# EAGLE design Adafruit DRV8871 (EAGLE 6.6.0)
COMPANY: ADAFRUIT INDUSTRIES; DRAWN: KTOWN; REV: A
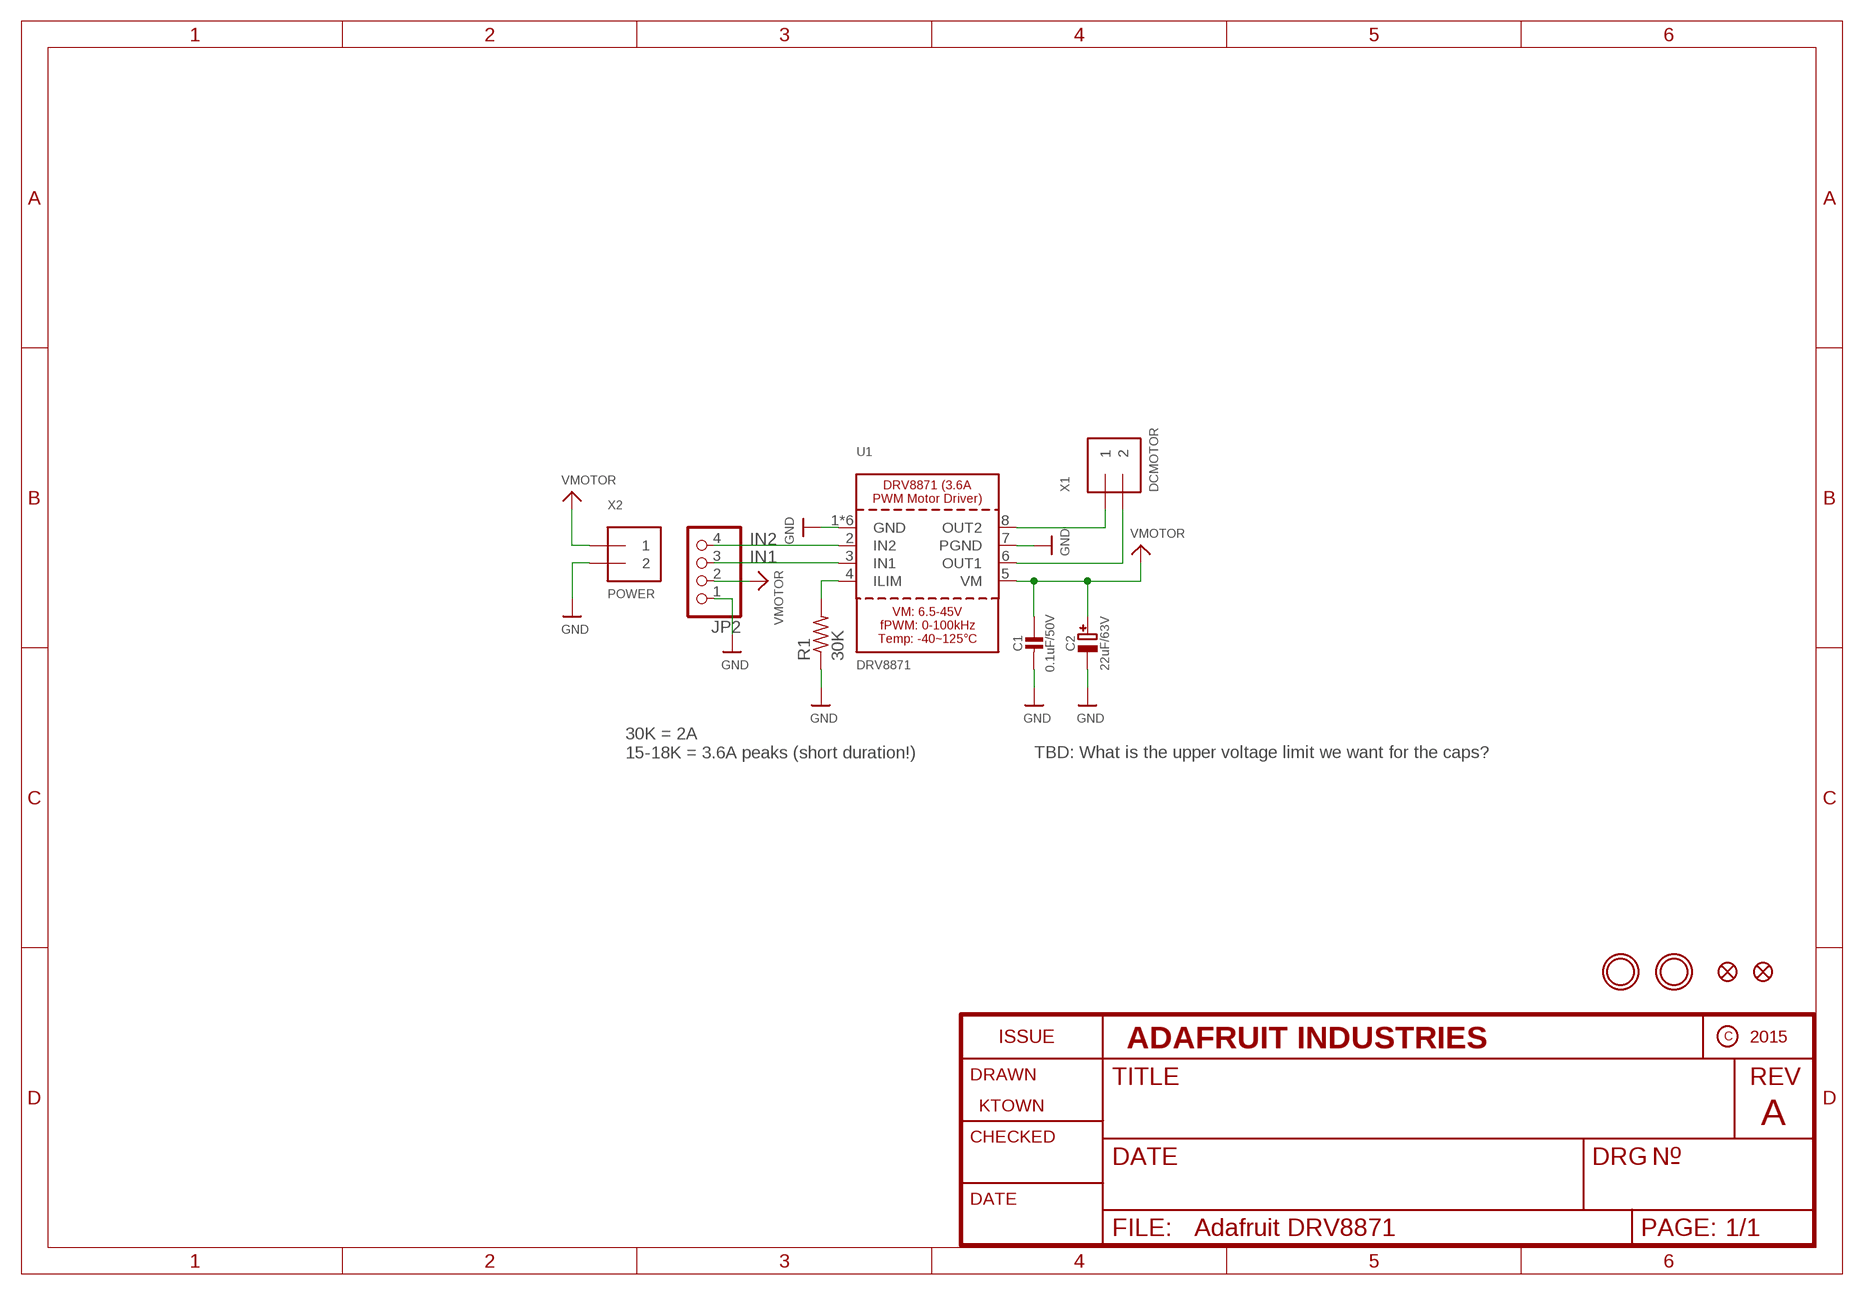
[diagram p0: schematic, sheet 1]

## Parts
C1  0.1uF/50V  CAP_CERAMIC0805-NOOUTLINE  [0805-NO]
C2  22uF/63V  CAP_ELECTROLYTICPANASONIC_D  [PANASONIC_D]
FID1  FIDUCIAL""  [FIDUCIAL_1MM]
FID2  FIDUCIAL""  [FIDUCIAL_1MM]
JP2  HEADER-1X476MIL  [1X04_ROUND_76]
R1  30K  FLIPFLOP-RES  [0805-THM]
U1  DRV8871  [HSOP8]
U$9  MOUNTINGHOLE2.5  [MOUNTINGHOLE_2.5_PLATED]
U$10  MOUNTINGHOLE2.5  [MOUNTINGHOLE_2.5_PLATED]
X1  DCMOTOR  TERMBLOCK_1X2  [TERMBLOCK_1X2-3.5MM]
X2  POWER  TERMBLOCK_1X2  [TERMBLOCK_1X2-3.5MM]

## Nets
GND: C1.2 C2.- JP2.1 R1.1 U1.1(GND) U1.7(PGND) U1.GND U1.P$1(GND) U1.P$2(GND) U1.P$3(GND) U1.P$4(GND) X2.2
IN1: JP2.3 U1.3(IN1)
IN2: JP2.4 U1.2(IN2)
N$1: R1.2 U1.4(ILIM)
OUT1: U1.6(OUT1) X1.2
OUT2: U1.8(OUT2) X1.1
VMOTOR: C1.1 C2.+ JP2.2 U1.5(VM) X2.1

## Notes on the sheet
- 30K = 2A
  15-18K = 3.6A peaks (short duration!)
- TBD: What is the upper voltage limit we want for the caps?

## Library data of the parts
C1 = microbuilder:CAP_CERAMIC: Ceramic Capacitors For new designs, use the packages preceded by an '_' character since they are more reliable: The following footprints should be used on most boards: _0402 - Standard footprint for regular board layouts _0603 - Standard footprint for regular board layouts _0805 - Standard footprint for regular board layouts _1206 - Standard footprint for regular board layouts For extremely tight-pitch boards where space is at a premium, the following 'micro-pitch' footprints can be used (smaller pads, no silkscreen outline, etc.): _0402MP - Micro-pitch footprint for very dense/compact boards _0603MP - Micro-pitch footprint for very dense/compact boards _0805MP - Micro-pitch footprint for very dense/compact boards _1206MP - Micro-pitch footprint for very dense/compact boards
C2 = microbuilder:CAP_ELECTROLYTIC: Electrolytic Capacitors SMT PANASONIC_C - Size C Panasonic Electrolytic Aluminum Capacitor 47µF 16V 20% Electrolytic Capacitor [Digikey: PCE3890TR-ND] PANASONIC_D - Size D Panasonic Electrolytic Aluminum Capacitor 100µF 25V 20% Electrolytic Capacitor [Digikey: PCE3898TR-ND] PTH 3.5 mm grid, 8 mm diameter ... 3.5 mm grid, 10 mm diameter ...
FID1 FID2 = microbuilder:FIDUCIAL: Fiducial Alignment Points Various fiducial points for machine vision alignment.; BOM: EXCLUDE
JP2 = microbuilder:HEADER-1X4: PIN HEADER
R1 = adafruit:FLIPFLOP-RES: Flip Flop resistor An 0805 resistor inside a standard 1/4W 5% resistor. Makes for easy mods
U1 = microbuilder:DRV8871: DRV8871 - 3.6A PWM Motor Driver
U$9 U$10 = microbuilder:MOUNTINGHOLE: Mounting Hole For #2 screws (0.086"/2.18mm width, 0.094"/2.4mm hole) use 2.5mm; BOM: EXCLUDE
X1 X2 = microbuilder:TERMBLOCK_1X2: 3.5mm Terminal block http://www.ladyada.net/library/pcb/eaglelibrary.html

## Board
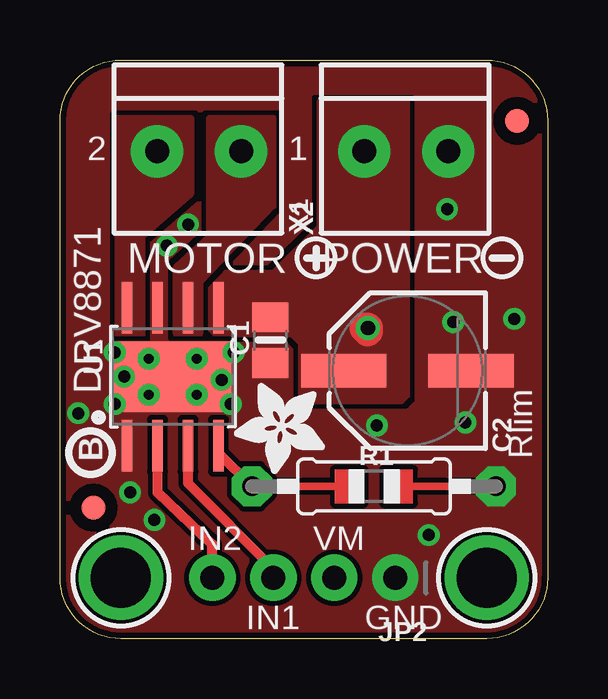
[diagram p1: board, top side]
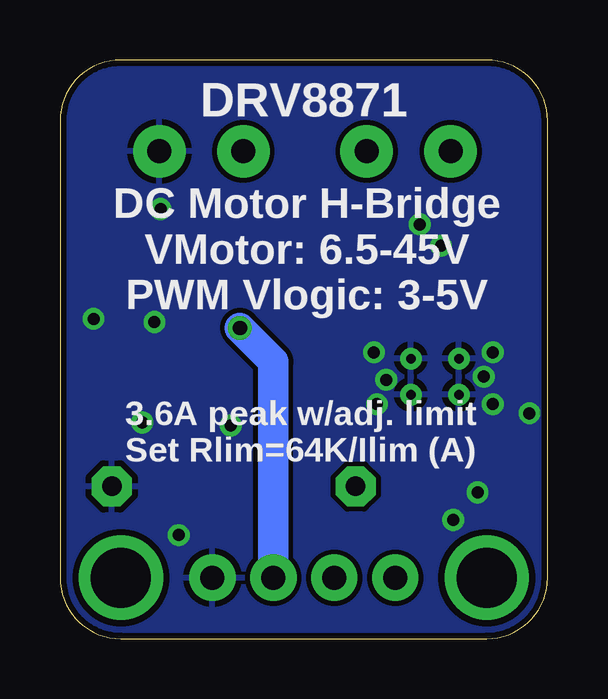
[diagram p2: board, bottom side, seen from below]

Size 20.32 x 24.13 mm. Coordinates in mm from the lower left corner, seen from the top.
Outline: 2.54,24.13 17.78,24.13 arc-90 20.32,21.59 20.32,2.54 arc-90 17.78,0 2.54,0 arc-90 0,2.54 0,21.59 arc-90 2.54,24.13
Copper layers (1*16): Top 0.035mm / dielectric 1.5mm / Bottom 0.035mm
Design rules "adafruit": minimum track width 8mil, minimum drill 15.5mil, track to track 8mil, track to pad 8mil, pad to pad 8mil, via to via 8mil, smd to smd 8mil, copper to edge 10mil, drill to drill 8mil, minimum pad ring 10mil, minimum via ring 8mil, stop-mask expansion 2mil, vias tented up to drill 20mil, thermal gap 10mil

### Footprints (pad centres in the part's own frame; a part is rotated, then mirrored left to right if it is on the bottom)
0805-NO = smd 1.24 x 1.5: 1 -0.95,0; 2 0.95,0
PANASONIC_D = smd 3.556 x 1.4: + 2.654,0; - -2.654,0
FIDUCIAL_1MM = smd 1 x 1: 1 0,0
1X04_ROUND_76 = drill 1 pad 1.93: 1 -3.81,0; 2 -1.27,0; 3 1.27,0; 4 3.81,0
0805-THM = drill 0.813 pad 1.676 octagon: 1 -5.08,0; 2 5.08,0
HSOP8 = smd 0.45 x 2.15: 1 -1.905,-2.875; 2 -0.635,-2.875; 3 0.635,-2.875; 4 1.905,-2.875; 5 1.905,2.875; 6 0.635,2.875; 7 -0.635,2.875; 8 -1.905,2.875 | smd 4.9 x 2.95: GND 0,0 | drill 0.4: P$1 -1,0.75; P$2 -1,-0.75; P$3 1,-0.75; P$4 1,0.75
MOUNTINGHOLE_2.5_PLATED = drill 2.5 pad 3.2: P$1 0,0
TERMBLOCK_1X2-3.5MM = drill 1 pad 2.184: 1 1.8,0; 2 -1.7,0

### Placement (x,y rotation side)
C1  8.76,12.45 270 top
C2  14.48,11.18 180 top
FID1  19.05,21.59 90 top
FID2  1.4,5.46 90 top
JP2  10.16,2.54 180 top
R1  13.08,6.35 180 top
U1  4.7,10.92 0 top
U$9  2.54,2.54 90 top
U$10  17.78,2.54 90 top
U$11  [SYMBOL_PLUS]  10.67,15.88 90 top
U$12  [SYMBOL_MINUS]  18.41,15.88 180 top
U$14  [ADAFRUIT_3.5MM]  11.05,10.67 180 top
U$15  [PCBFEAT-REV-040]  1.27,7.75 90 top
X1  5.84,20.32 180 top
X2  14.48,20.32 180 top

### Tracks (layer width: path | path; a pad name or v marks a point on that pad's centre or on a via)
GND  (via drill 0.5)
  other vias: 6.73,10.79 2.29,9.78 2.67,10.92 2.29,11.94 7.11,9.78 7.24,11.94 2.92,6.1 0.76,9.4 3.94,4.95 4.45,16.38 16.13,17.91 18.92,13.34 16.38,13.21 16.89,9.02 15.37,4.32 13.21,8.89 5.33,17.27
  pour Top (rank 6, no thermals): 0,24.13 0,0 20.32,0 20.32,24.13
  pour Bottom (rank 6): 0,24.13 0,0 20.32,0 20.32,24.13
IN1
  Top 0.406: JP2.3 8.89,2.92 5.33,6.48 U1.3
IN2
  Top 0.406: JP2.4 6.35,3.94 4.06,6.1 U1.2
N$1
  Top 0.406: U1.4 6.6,7.75 R1.2
OUT1
  pour Top (no thermals): 4.83,12.7 4.83,15.49 6.22,16.76 6.22,21.72 8.89,21.72 8.89,18.03 5.84,14.86 5.84,12.7
OUT2
  pour Top (no thermals): 2.41,12.32 2.41,21.72 5.46,21.72 5.46,18.54 3.43,16.76 3.43,12.32
VMOTOR  (via drill 0.6)
  Top 1.27: v12.83,12.95 12.83,12.83 12.7,12.95
  Bottom 1.27: JP2.2 11.43,11.56 v12.83,12.95
  pour Top (rank 2, no thermals): 10.79,22.35 10.79,17.14 8.89,15.24 6.35,15.24 6.22,15.11 6.22,12.95 6.48,12.7 9.65,12.7 10.03,12.32 10.03,10.16 10.29,9.91 14.22,9.91 14.48,10.16 14.48,22.35

### Text on the board
tPlace: 2 | 1 | POWER | MOTOR | DRV8871 | Rlim | IN2 | VM | IN1 | GND
bPlace: DRV8871 | DC Motor H-Bridge / VMotor: 6.5-45V / PWM Vlogic: 3-5V | 3.6A peak w/adj. limit / Set Rlim=64K/Ilim (A)